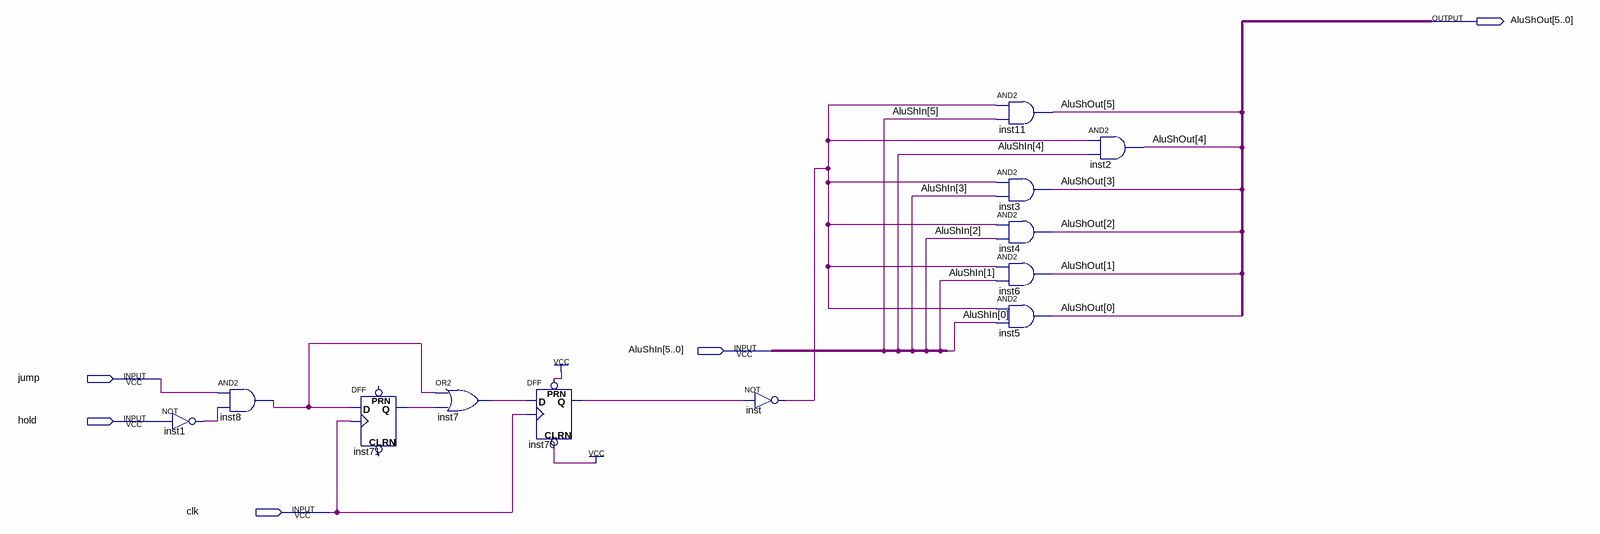
[diagram p0: schematic sheet]
// Quartus schematic Alu_jump.bdf as structural Verilog: 12 symbols, 5 pins
module Alu_jump (
  input  [5:0] AluShIn,
  input  jump,
  input  hold,
  input  clk,
  output [5:0] AluShOut
);

  wire inst1_out, inst7_out, inst8_out, inst70_q, inst71_q, inst_out;

  not inst1 (inst1_out, hold);
  and inst8 (inst8_out, jump, inst1_out);
  DFF inst71 (.CLK(clk), .D(inst8_out), .Q(inst71_q));  // open: CLRN, PRN
  or inst7 (inst7_out, inst8_out, inst71_q);
  DFF inst70 (.CLRN(1'b1), .CLK(clk), .D(inst7_out), .PRN(1'b1), .Q(inst70_q));
  not inst (inst_out, inst70_q);
  and inst11 (AluShOut[5], inst_out, AluShIn[5]);
  and inst3 (AluShOut[3], inst_out, AluShIn[3]);
  and inst4 (AluShOut[2], inst_out, AluShIn[2]);
  and inst6 (AluShOut[1], inst_out, AluShIn[1]);
  and inst5 (AluShOut[0], inst_out, AluShIn[0]);
  and inst2 (AluShOut[4], inst_out, AluShIn[4]);
endmodule
